# EAGLE design 8Bit-audio-7524-axelb-v2 (EAGLE 9.6.2)
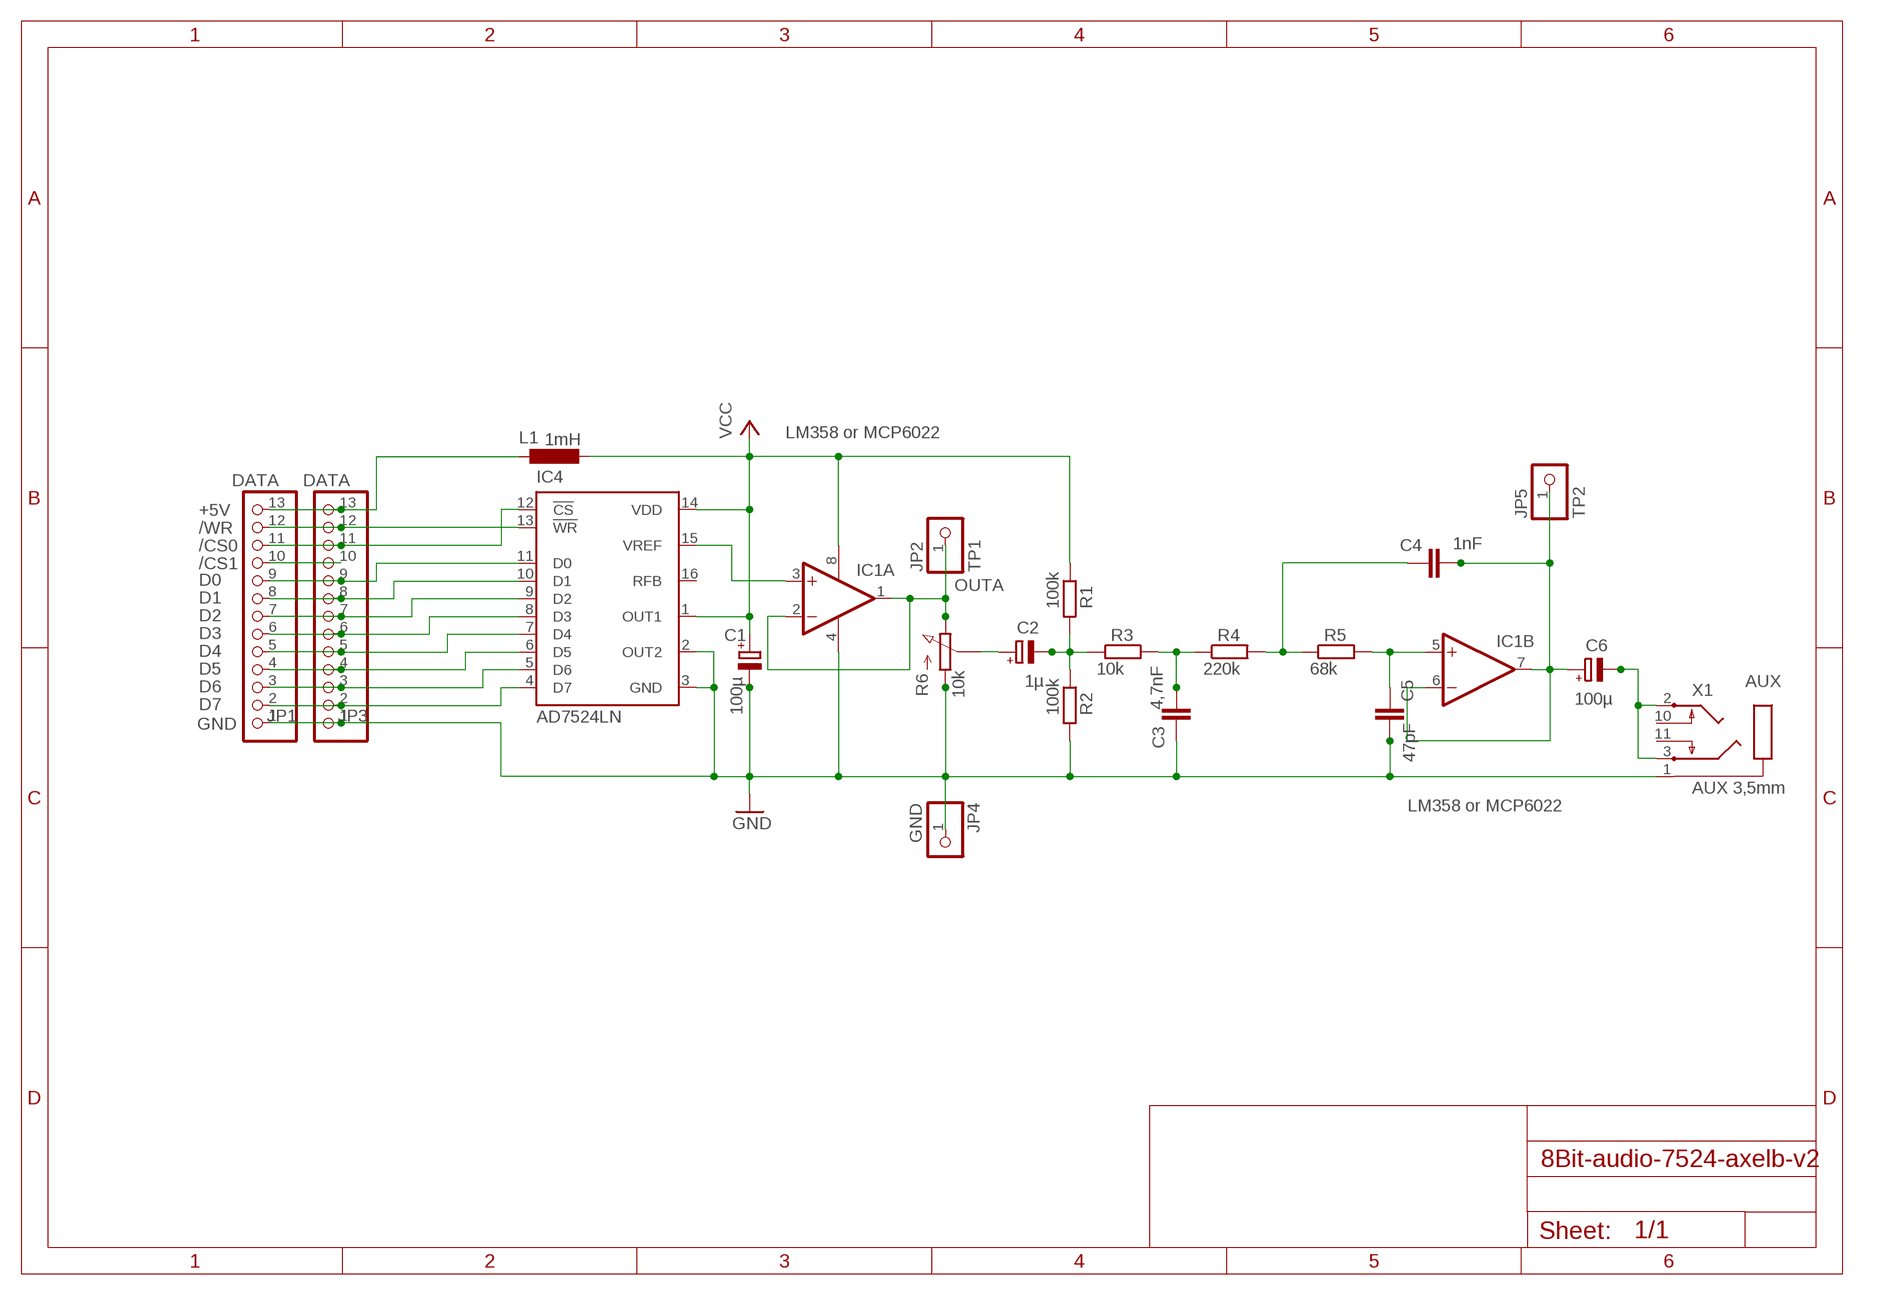
[diagram p0: schematic, sheet 1]

## Parts
C1  100µ  CPOL-EUE2.5-7  [E2,5-7]
C2  1µ  CPOL-EUE2.5-7  [E2,5-7]
C3  4,7nF  RCL_C-EU025_050-055X075  [RCL_C025_050-055X075]
C4  1nF  RCL_C-EU025_050-055X075  [RCL_C025_050-055X075]
C5  47pF  RCL_C-EU025_050-055X075  [RCL_C025_050-055X075]
C6  100µ  CPOL-EUE2.5-7  [E2,5-7]
IC1  LM358 or MCP6022  LM358N  [DIL08]
IC4  AD7524LN  [DIL16]
JP1  DATA  PINHD-1X13  [1X13]
JP2  TP1  PINHD-1X1  [1X01]
JP3  DATA  PINHD-1X13  [1X13]
JP4  GND  PINHD-1X1  [1X01]
JP5  TP2  PINHD-1X1  [1X01]
L1  1mH  L-EU0207/10  [0207/10]
R1  100k  R-EU_0207/10  [0207/10]
R2  100k  R-EU_0207/10  [0207/10]
R3  10k  R-EU_0207/10  [0207/10]
R4  220k  R-EU_0207/10  [0207/10]
R5  68k  R-EU_0207/10  [0207/10]
R6  10k  POT_3RP/1610N  [POT_3RP/1610N]
X1  AUX 3,5mm  CON-SJ1-352XNSJ1-352XN  [SJ1-352XN]

## Nets
+5V: JP1.13 JP3.13 L1.1
/CS0: IC4.12(!CS) JP1.11 JP3.11
/CS1: JP1.10 JP3.10
/WR: IC4.13(!WR) JP1.12 JP3.12
AUX: C6.- C6.-1(-2) X1.2 X1.3
D0: IC4.11(D0) JP1.9 JP3.9
D1: IC4.10(D1) JP1.8 JP3.8
D2: IC4.9(D2) JP1.7 JP3.7
D3: IC4.8(D3) JP1.6 JP3.6
D4: IC4.7(D4) JP1.5 JP3.5
D5: IC4.6(D5) JP1.4 JP3.4
D6: IC4.5(D6) JP1.3 JP3.3
D7: IC4.4(D7) JP1.2 JP3.2
GND: C1.- C1.-1(-2) C3.1(A1) C5.2(B1) C5.3(B2) IC1.4(P:V-) IC4.2(OUT2) IC4.3(GND) JP1.1 JP3.1 JP4.1 R2.2 R6.A1 R6.A2 X1.1
N$3: C2.- C2.-1(-2) R1.2 R2.1 R3.1
N$5: C2.+ R6.M(S)
N$6: C3.2(B1) C3.3(B2) R3.2 R4.1
N$7: C4.1(A1) R4.2 R5.1
N$9: C5.1(A1) IC1.5(B:+IN) R5.2
OUTA: IC1.1(A:OUT) IC1.2(A:-IN) JP2.1 R6.E1 R6.E2
OUTB: C4.2(B1) C4.3(B2) C6.+ IC1.6(B:-IN) IC1.7(B:OUT) JP5.1
VCC: C1.+ IC1.8(P:V+) IC4.1(OUT1) IC4.14(VDD) L1.2 R1.1
VREF: IC1.3(A:+IN) IC4.15(VREF)
Unconnected: IC4.16(RFB) X1.10 X1.11

## Library data of the parts
C1 C2 C6 = myLbr:CPOL-EU: POLARIZED CAPACITOR, European symbol; SPICEPREFIX: C
C3-C5 = myLbr:RCL_C-EU: CAPACITOR, European symbol; SPICEPREFIX: C
IC1 = linear:LM358: OP AMP also LM158; LM258; LM2904 Source: http://cache.national.com/ds/LM/LM158.pdf
IC4 = analog-devices:AD7524*: 8-Bit Buffered Multiplying DAC Source: http://www.analog.com/UploadedFiles/Data_Sheets/888358036ad7524.pdf; MF: ALTERA CORPORATION; MPN: AD7524LNZ; OC_FARNELL: 9605401; OC_NEWARK: 59K4974
JP1 JP3 = pinhead:PINHD-1X13: PIN HEADER
JP2 JP4 JP5 = pinhead:PINHD-1X1: PIN HEADER
L1 = rcl:L-EU: INDUCTOR, European symbol; SPICEPREFIX: L
R1-R5 = rcl:R-EU_: RESISTOR, European symbol; SPICEPREFIX: R
R6 = myLbr:POT_3RP/1610N: 16mm Potentiometer one level Source: http://www.alphapotentiometers.net/html/16mm_pot_2.html
X1 = CON SJ1-352XN:CON-SJ1-352XN: MIC/HEADPHONE JACK KS-S stereo microphone/headphone jack SJ1-352XN (CUD Devices)

## Board
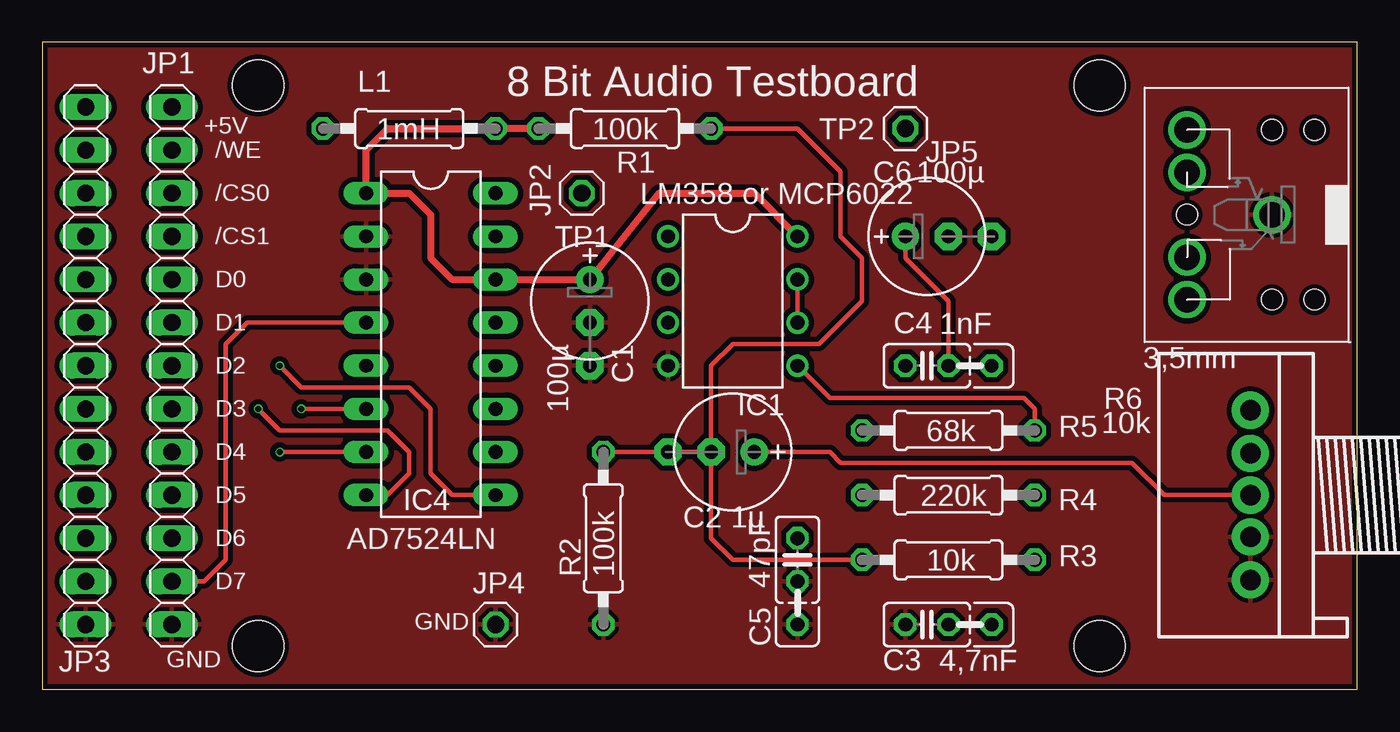
[diagram p1: board, top side]
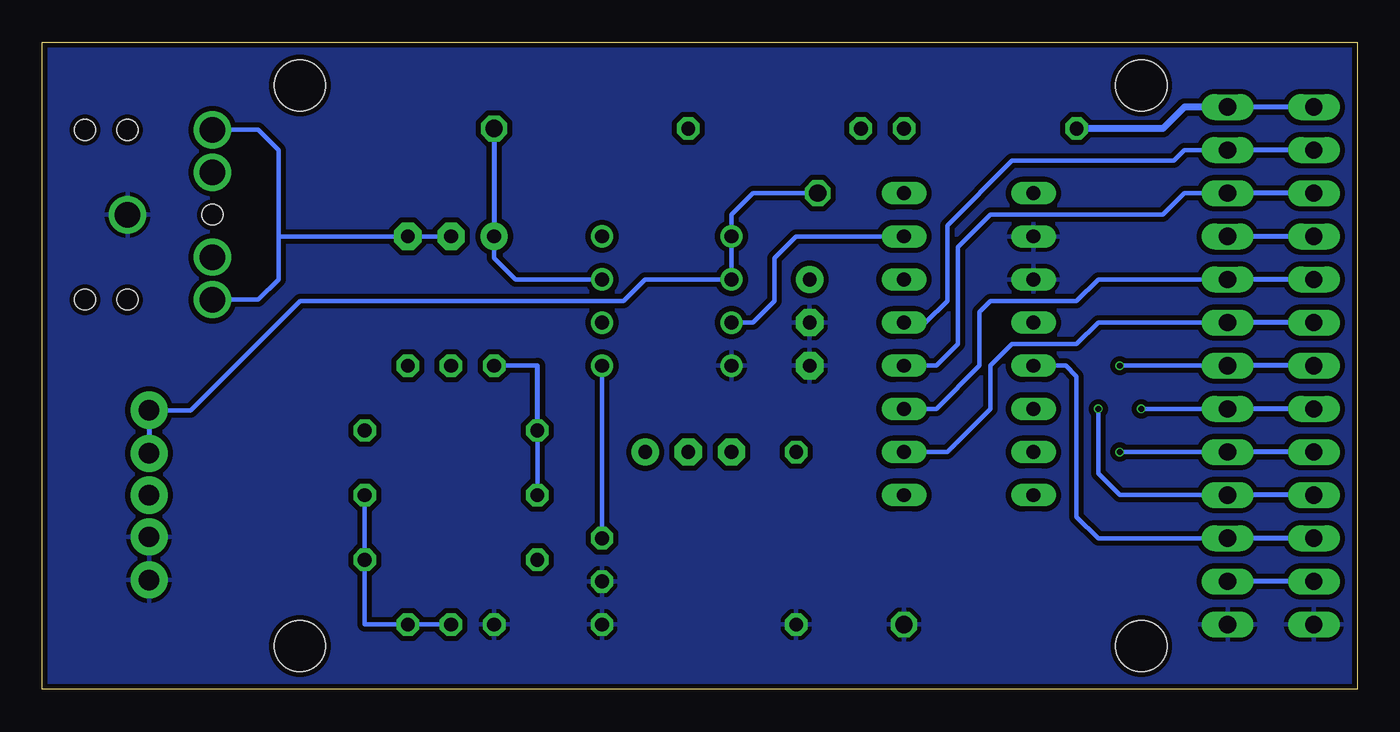
[diagram p2: board, bottom side, seen from below]

Size 77.39 x 38.09 mm. Coordinates in mm from the lower left corner, seen from the top.
Outline: 0,0 77.39,0 77.39,38.09 0,38.09 0,0
Copper layers (1*16): Top 0.035mm / dielectric 1.6mm / Bottom 0.035mm
Design rules "jlcpcb-2layers *": minimum track width 5mil, minimum drill 0.3mm, track to track 5mil, track to pad 5mil, pad to pad 5mil, via to via 5mil, smd to smd 5mil, copper to edge 0.2mm, drill to drill 6mil, minimum pad ring 10mil, minimum via ring 3mil, stop-mask expansion 4mil, vias tented up to drill 0mil, thermal gap 10mil
Holes 3 mm at 12.7,35.56 62.23,2.54 62.23,35.56 12.7,2.54

### Footprints (pad centres in the part's own frame; a part is rotated, then mirrored left to right if it is on the bottom)
E2,5-7 = drill 0.813 pad 1.6: + -1.27,0 | drill 0.813 pad 1.6 octagon: - 1.27,0; -1 3.81,0
RCL_C025_050-055X075 = drill 0.813 octagon: 1 -1.27,0; 2 1.27,0; 3 3.81,0
DIL08 = drill 0.813 pad 1.27: 1 -3.81,-3.81; 2 -1.27,-3.81; 3 1.27,-3.81; 4 3.81,-3.81; 5 3.81,3.81; 6 1.27,3.81; 7 -1.27,3.81; 8 -3.81,3.81
DIL16 = drill 0.813 long: 1 -8.89,-3.81; 2 -6.35,-3.81; 3 -3.81,-3.81; 4 -1.27,-3.81; 5 1.27,-3.81; 6 3.81,-3.81; 7 6.35,-3.81; 8 8.89,-3.81; 9 8.89,3.81; 10 6.35,3.81; 11 3.81,3.81; 12 1.27,3.81; 13 -1.27,3.81; 14 -3.81,3.81; 15 -6.35,3.81; 16 -8.89,3.81
1X13 = drill 1.016 long: 1 -15.24,0; 2 -12.7,0; 3 -10.16,0; 4 -7.62,0; 5 -5.08,0; 6 -2.54,0; 7 0,0; 8 2.54,0; 9 5.08,0; 10 7.62,0; 11 10.16,0; 12 12.7,0; 13 15.24,0
1X01 = drill 1.016 octagon: 1 0,0
0207/10 = drill 0.813 octagon: 1 -5.08,0; 2 5.08,0
POT_3RP/1610N = drill 1.2 pad 2.184: A1 -5,0; A2 -2.46,0; E1 5,0; E2 2.46,0; M 0,0
SJ1-352XN = drill 1.5 pad 2.184: 1 0,0; 2 5,-5; 3 5,5; 10 5,-2.5; 11 5,2.5 | hole 1.2: 5,0; 0,5; 0,-5; -2.5,-5; -2.5,5

### Placement (x,y rotation side)
C1  32.23,22.86 270 top
C2  40.64,13.97 180 top
C3  52.07,3.81 0 top
C4  52.07,19.05 0 top
C5  44.45,7.62 270 top
C6  52.07,26.67 0 top
IC1  40.64,22.86 270 top
IC4  22.86,20.32 270 top
JP1  7.62,19.05 90 top
JP2  31.75,29.21 0 top
JP3  2.54,19.05 90 top
JP4  26.67,3.81 0 top
JP5  50.8,33.02 0 top
L1  21.59,33.02 0 top
R1  34.29,33.02 0 top
R2  33.02,8.89 270 top
R3  53.34,7.62 0 top
R4  53.34,11.43 180 top
R5  53.34,15.24 0 top
R6  71.12,11.43 90 top
X1  72.39,27.94 180 top

### Tracks (layer width: path | path; a pad name or v marks a point on that pad's centre or on a via)
+5V
  Bottom 0.305: JP3.13 JP1.13
  Bottom 0.406: JP1.13 10.16,34.29 11.43,33.02 L1.1
/CS0
  Bottom 0.254: JP1.11 10.16,29.21 11.43,27.94 21.59,27.94 23.5,26.04 23.5,20.32 24.77,19.05 IC4.12
  Bottom 0.305: JP3.11 JP1.11
/CS1
  Bottom 0.305: JP3.10 JP1.10
/WR
  Bottom 0.254: JP1.12 10.16,31.75 10.79,31.11 20.32,31.11 24.13,27.3 24.13,22.86 25.4,21.59 IC4.13
  Bottom 0.305: JP3.12 JP1.12
AUX
  Bottom 0.254: X1.2 64.69,32.94 63.5,31.75 63.5,26.67 | X1.3 64.69,22.94 63.5,24.13 63.5,26.67 | C6.- C6.-1 63.5,26.67
D0
  Bottom 0.254: JP1.9 15.24,24.13 16.51,22.86 21.59,22.86 22.23,22.23 22.23,19.05 24.77,16.51 IC4.11
  Bottom 0.305: JP3.9 JP1.9
D1
  Bottom 0.254: IC4.10 24.13,13.97 21.59,16.51 21.59,19.05 20.32,20.32 16.51,20.32 15.24,21.59 JP1.8
  Bottom 0.305: JP3.8 JP1.8
D2  (via drill 0.35)
  Top 0.254: IC4.9 24.13,11.43 22.86,12.7 22.86,16.51 21.59,17.78 15.24,17.78 v13.97,19.05
  Bottom 0.254: JP1.7 v13.97,19.05
  Bottom 0.305: JP3.7 JP1.7
D3  (via drill 0.35)
  Top 0.254: v12.7,16.51 13.97,15.24 20.32,15.24 21.59,13.97 21.59,12.7 20.32,11.43 IC4.8
  Bottom 0.254: v12.7,16.51 JP1.6
  Bottom 0.305: JP3.6 JP1.6
D4  (via drill 0.35)
  Top 0.254: v13.97,13.97 IC4.7
  Bottom 0.254: JP1.5 v13.97,13.97
  Bottom 0.305: JP3.5 JP1.5
D5  (via drill 0.35)
  Top 0.254: v15.24,16.51 IC4.6
  Bottom 0.254: JP1.4 13.97,11.43 15.24,12.7 v15.24,16.51
  Bottom 0.305: JP3.4 JP1.4
D6
  Bottom 0.254: IC4.5 17.14,19.05 16.51,18.41 16.51,10.16 15.24,8.89 JP1.3
  Bottom 0.305: JP3.3 JP1.3
D7
  Top 0.254: JP1.2 9.53,6.35 10.79,7.62 10.79,20.32 12.06,21.59 IC4.4
  Bottom 0.305: JP3.2 JP1.2
GND
  pour Bottom (isolate 0.305): 0,0 77.47,0 77.47,38.1 0,38.1
  pour Top (isolate 0.305): 0,0 0,38.1 77.47,38.1 77.47,0
N$3
  Top 0.254: R1.2 44.45,33.02 46.99,30.48 46.99,26.67 48.26,25.4 48.26,22.86 45.72,20.32 40.64,20.32 39.37,19.05 C2.- | R3.1 40.64,7.62 39.37,8.89 C2.- | C2.- C2.-1 R2.1
N$5
  Top 0.254: R6.M 66.04,11.43 64.14,13.34 46.99,13.34 46.35,13.97 C2.+
N$6
  Bottom 0.254: R4.1 R3.2 58.42,3.81 C3.3 C3.2
N$7
  Bottom 0.254: R5.1 R4.2 | 48.26,19.05 C4.1
  Bottom 0.305: R5.1 48.26,19.05
N$9
  Top 0.254: R5.2 58.42,16.51 57.78,17.14 46.35,17.14 IC1.5
  Bottom 0.254: C5.1 IC1.5
OUTA
  Bottom 0.254: JP2.1 35.56,29.21 36.83,27.94 IC1.1 IC1.2 41.91,24.13 43.18,22.86 62.23,22.86 68.66,16.43 R6.E1
  Bottom 0.305: R6.E1 R6.E2
OUTB
  Top 0.254: IC1.6 IC1.7 | C4.3 C4.2 53.34,22.86 50.8,25.4 C6.+
  Bottom 0.254: IC1.7 49.53,24.13 50.8,25.4 C6.+
  Bottom 0.305: JP5.1 C6.+
VCC
  Top 0.406: R1.1 L1.2 20.32,33.02 19.05,31.75 IC4.1 21.59,29.21 22.86,27.94 22.86,25.4 24.13,24.13 IC4.14 C1.+ 36.29,29.21 41.91,29.21 IC1.8
VREF
  Bottom 0.254: IC4.15 33.02,26.67 34.29,25.4 34.29,22.86 35.56,21.59 IC1.3

### Text on the board
tPlace: 8 Bit Audio Testboard | +5V | /WE | /CS0 | /CS1 | D0 | D1 | D2 | D3 | D4 | D5 | D6 | D7 | GND | GND